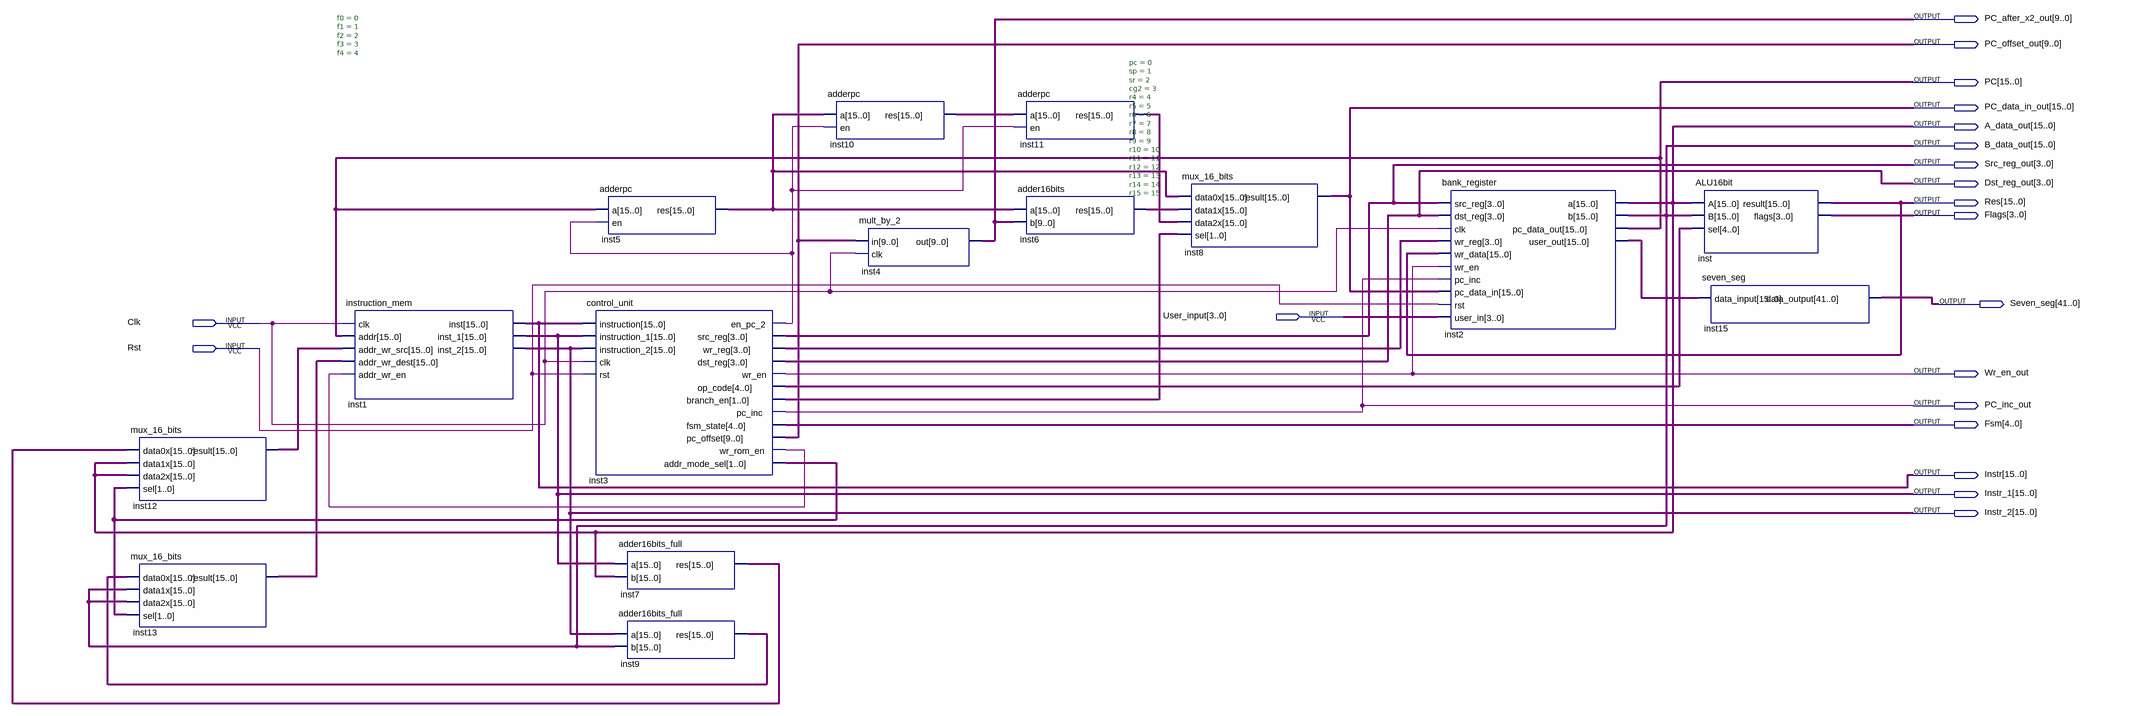
[diagram p0: schematic sheet]
// Quartus schematic MSP430x2xx_block_diagram.bdf as structural Verilog: 15 symbols, 20 pins
module MSP430x2xx_block_diagram (
  input  [3:0] User_input,
  input  Clk,
  input  Rst,
  output [9:0] PC_after_x2_out,
  output [9:0] PC_offset_out,
  output [15:0] PC,
  output [15:0] PC_data_in_out,
  output [15:0] A_data_out,
  output [15:0] B_data_out,
  output [3:0] Src_reg_out,
  output [3:0] Dst_reg_out,
  output [15:0] Res,
  output [3:0] Flags,
  output [41:0] Seven_seg,
  output Wr_en_out,
  output PC_inc_out,
  output [4:0] Fsm,
  output [15:0] Instr,
  output [15:0] Instr_1,
  output [15:0] Instr_2
);

  wire inst3_en_pc_2, inst3_wr_rom_en;
  wire [1:0] inst3_addr_mode_sel, inst3_branch_en;
  wire [3:0] inst3_wr_reg;
  wire [4:0] inst3_op_code;
  wire [15:0] inst2_user_out, inst5_res, inst6_res, inst7_res, inst9_res, inst10_res, inst11_res,
       inst12_result, inst13_result;

  mux_16_bits inst12 (
    .data0x(inst7_res), .data1x(A_data_out), .data2x(A_data_out), .sel(inst3_addr_mode_sel),
    .result(inst12_result));
  mux_16_bits inst13 (
    .data0x(inst9_res), .data1x(B_data_out), .data2x(B_data_out), .sel(inst3_addr_mode_sel),
    .result(inst13_result));
  instruction_mem inst1 (
    .clk(Clk), .addr(PC), .addr_wr_src(inst12_result), .addr_wr_dest(inst13_result),
    .addr_wr_en(inst3_wr_rom_en), .inst(Instr), .inst_1(Instr_1), .inst_2(Instr_2));
  adderpc inst5 (.a(PC), .en(inst3_en_pc_2), .res(inst5_res));
  control_unit #(.f0(0), .f1(1), .f2(2), .f3(3), .f4(4)) inst3 (
    .instruction(Instr), .instruction_1(Instr_1), .instruction_2(Instr_2), .clk(Clk), .rst(Rst),
    .en_pc_2(inst3_en_pc_2), .src_reg(Src_reg_out), .wr_reg(inst3_wr_reg), .dst_reg(Dst_reg_out),
    .wr_en(Wr_en_out), .op_code(inst3_op_code), .branch_en(inst3_branch_en), .pc_inc(PC_inc_out),
    .fsm_state(Fsm), .pc_offset(PC_offset_out), .wr_rom_en(inst3_wr_rom_en),
    .addr_mode_sel(inst3_addr_mode_sel));
  adder16bits_full inst7 (.a(Instr_1), .b(A_data_out), .res(inst7_res));
  adder16bits_full inst9 (.a(Instr_2), .b(B_data_out), .res(inst9_res));
  adderpc inst10 (.a(inst5_res), .en(inst3_en_pc_2), .res(inst10_res));
  mult_by_2 inst4 (.in(PC_offset_out), .clk(Clk), .out(PC_after_x2_out));
  adderpc inst11 (.a(inst10_res), .en(inst3_en_pc_2), .res(inst11_res));
  adder16bits inst6 (.a(inst5_res), .b(PC_after_x2_out), .res(inst6_res));
  mux_16_bits inst8 (
    .data0x(inst5_res), .data1x(inst6_res), .data2x(inst11_res), .sel(inst3_branch_en),
    .result(PC_data_in_out));
  bank_register #(.pc(0), .sp(1), .sr(2), .cg2(3), .r4(4), .r5(5), .r6(6), .r7(7), .r8(8), .r9(9), .r10(10), .r11(11), .r12(12), .r13(13), .r14(14), .r15(15)) inst2 (
    .src_reg(Src_reg_out), .dst_reg(Dst_reg_out), .clk(Clk), .wr_reg(inst3_wr_reg), .wr_data(Res),
    .wr_en(Wr_en_out), .pc_inc(PC_inc_out), .pc_data_in(PC_data_in_out), .rst(Rst), .user_in(User_input),
    .a(A_data_out), .b(B_data_out), .pc_data_out(PC), .user_out(inst2_user_out));
  ALU16bit inst (.A(A_data_out), .B(B_data_out), .sel(inst3_op_code), .result(Res), .flags(Flags));
  seven_seg inst15 (.data_input(inst2_user_out), .data_output(Seven_seg));
endmodule
